# Altium schematic sheet analog.SchDoc
size A3; SheetNumber: 4; SheetTotal: 4
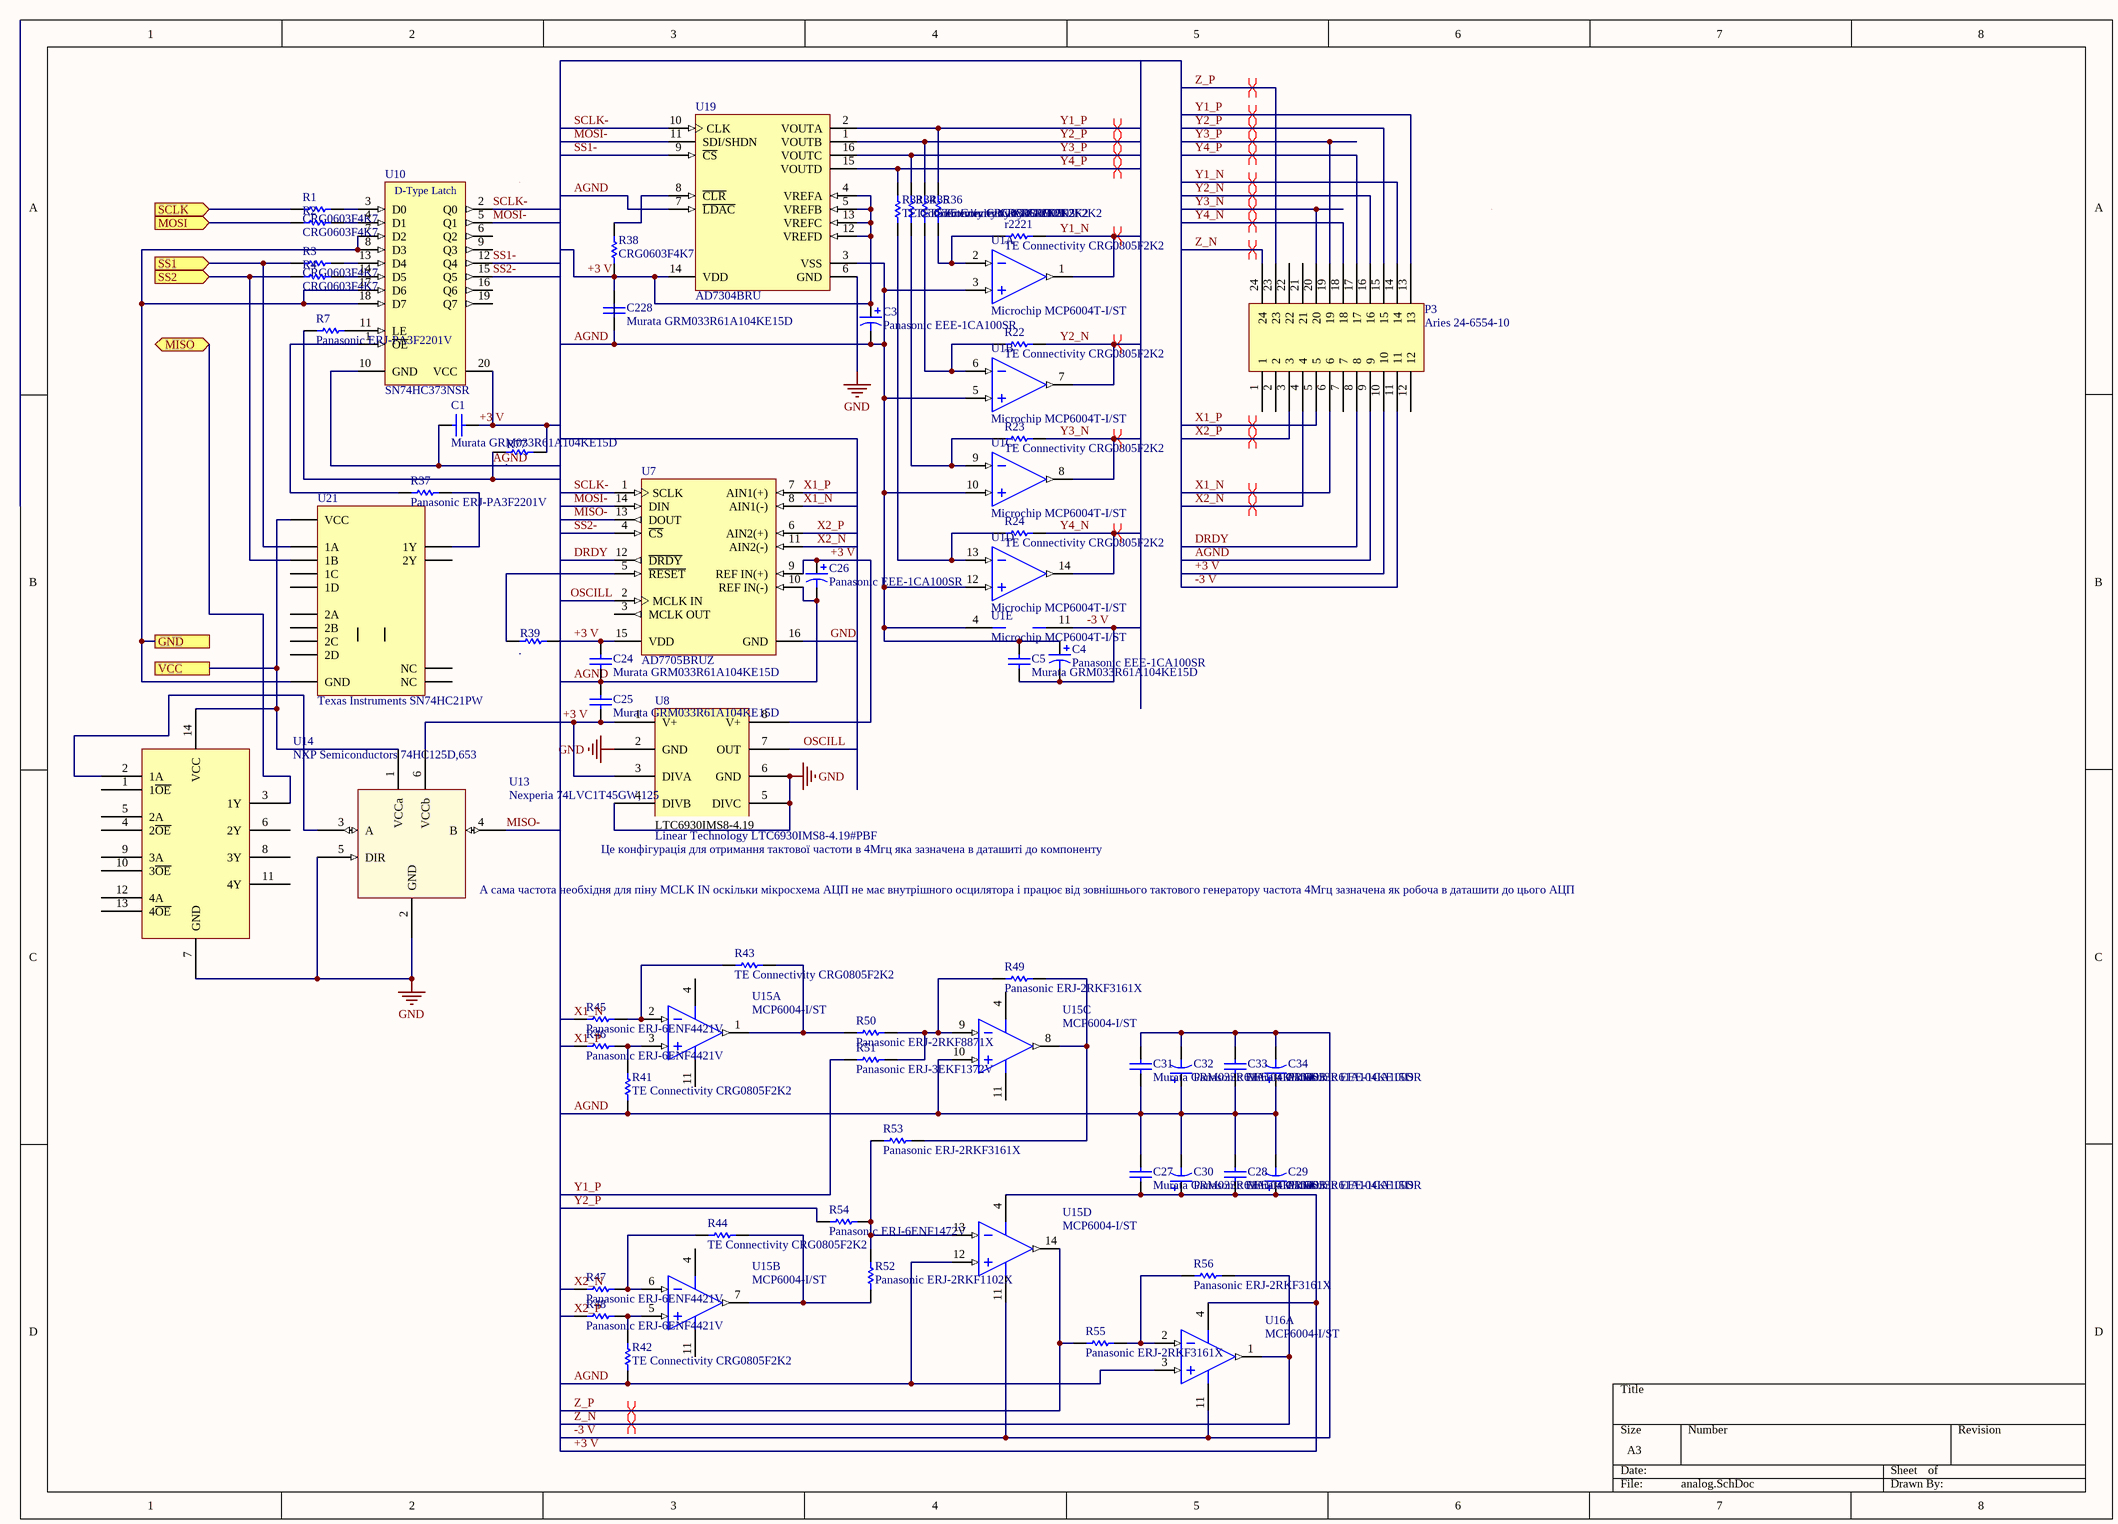
[diagram p0: analog.SchDoc]

## Parts
C1  Murata GRM033R61A104KE15D  [201-cap]
C3  Panasonic EEE-1CA100SR  [PCB-5c7lwdch6d5n3jfyiyq6-1]
C4  Panasonic EEE-1CA100SR  [PCB-5c7lwdch6d5n3jfyiyq6-1]
C5  Murata GRM033R61A104KE15D  [201-cap]
C24  Murata GRM033R61A104KE15D  [201-cap]
C25  Murata GRM033R61A104KE15D  [201-cap]
C26  Panasonic EEE-1CA100SR  [PCB-5c7lwdch6d5n3jfyiyq6-1]
C27  Murata GRM033R61A104KE15D  [201-cap]
C28  Murata GRM033R61A104KE15D  [201-cap]
C29  Panasonic EEE-1CA100SR  [PCB-5c7lwdch6d5n3jfyiyq6-1]
C30  Panasonic EEE-1CA100SR  [PCB-5c7lwdch6d5n3jfyiyq6-1]
C31  Murata GRM033R61A104KE15D  [201-cap]
C32  Panasonic EEE-1CA100SR  [PCB-5c7lwdch6d5n3jfyiyq6-1]
C33  Murata GRM033R61A104KE15D  [201-cap]
C34  Panasonic EEE-1CA100SR  [PCB-5c7lwdch6d5n3jfyiyq6-1]
C228  Murata GRM033R61A104KE15D  [201-cap]
P3  Aries 24-6554-10  [PCB-ekyruasckp3dwikngkzw-1]
R1  CRG0603F4K7  [RESC1609X50X30ML10T20]
R2  CRG0603F4K7  [RESC1609X50X30ML10T20]
R3  CRG0603F4K7  [RESC1609X50X30ML10T20]
R4  CRG0603F4K7  [RESC1609X50X30ML10T20]
R7  Panasonic ERJ-PA3F2201V  [RESC1608X55X30LL15T15]
R22  TE Connectivity CRG0805F2K2  [RESC3216X70X50LL05T20]
R23  TE Connectivity CRG0805F2K2  [RESC3216X70X50LL05T20]
R24  TE Connectivity CRG0805F2K2  [RESC3216X70X50LL05T20]
R33  TE Connectivity CRG0805F2K2  [RESC3216X70X50LL05T20]
R34  TE Connectivity CRG0805F2K2  [RESC3216X70X50LL05T20]
R35  TE Connectivity CRG0805F2K2  [RESC3216X70X50LL05T20]
R36  TE Connectivity CRG0805F2K2  [RESC3216X70X50LL05T20]
R37  Panasonic ERJ-PA3F2201V  [RESC1608X55X30LL15T15]
R38  CRG0603F4K7  [RESC1609X50X30ML10T20]
R39  .  [RESC1608X55X30LL15T15]
R41  TE Connectivity CRG0805F2K2  [RESC3216X70X50LL05T20]
R42  TE Connectivity CRG0805F2K2  [RESC3216X70X50LL05T20]
R43  TE Connectivity CRG0805F2K2  [RESC3216X70X50LL05T20]
R44  TE Connectivity CRG0805F2K2  [RESC3216X70X50LL05T20]
R45  Panasonic ERJ-6ENF4421V  [RESC2013X70X40ML20T20]
R46  Panasonic ERJ-6ENF4421V  [RESC2013X70X40ML20T20]
R47  Panasonic ERJ-6ENF4421V  [RESC2013X70X40ML20T20]
R48  Panasonic ERJ-6ENF4421V  [RESC2013X70X40ML20T20]
R49  Panasonic ERJ-2RKF3161X  [RESC1005X40X25ML05T05]
R50  Panasonic ERJ-2RKF8871X  [RESC1005X40X25ML05T05]
R51  Panasonic ERJ-3EKF1372V  [RESC1608X55X30LL15T15]
R52  Panasonic ERJ-2RKF1102X  [RESC1005X40X25ML05T05]
R53  Panasonic ERJ-2RKF3161X  [RESC1005X40X25ML05T05]
R54  Panasonic ERJ-6ENF1472V  [RESC2013X70X40LL20T20]
R55  Panasonic ERJ-2RKF3161X  [RESC1005X40X25ML05T05]
R56  Panasonic ERJ-2RKF3161X  [RESC1005X40X25ML05T05]
R77  .  [RESC1608X55X30LL15T15]
r2221  TE Connectivity CRG0805F2K2  [RESC3216X70X50LL05T20]
U1  Microchip MCP6004T-I/ST  [PCB-qd5l9gv8ivpyuc7qt6ns-1]  (parts A,B,C,D,E of 5)
U7  AD7705BRUZ  [RU-16_N]
U8  Linear Technology LTC6930IMS8-4.19#PBF  [PCB-f6jmd1xdx0tvjqeq7wyy-1]
U10  SN74HC373NSR  [PCB-mrivl7f71t22rnyfb9oh-1]
U13  Nexperia 74LVC1T45GW,125  [PCB-2kx227qvn7pif93bx96a-1]
U14  NXP Semiconductors 74HC125D,653  [SO14]
U15  MCP6004-I/ST  [TSSOP-ST14_L]  (parts A,B,C,D of 4)
U16  MCP6004-I/ST  [TSSOP-ST14_L]  (part A of 4)
U19  AD7304BRU  [RU-16_M]
U21  Texas Instruments SN74HC21PW  [PCB-zlibg0os7u66y1b7c6dv-1]

## Ports
GND, MISO (bidir), MOSI (in), SCLK (in), SS1 (in), SS2 (in), VCC

## Nets
GND: U7.16(GND) U8.2(GND) U8.4(DIVB) U8.5(DIVC) U8.6(GND) U13.2(GND) U13.5(DIR) U14.7(GND) U19.6(GND)
+3 V: C1.2 C3.1 C24.1 C25.2 C26.1 C27.2 C28.2 C29.1 C30.1 C228.1 P3.10 R38.1 R39.2 R77.2 U7.9(REF_IN(+)) U7.15(VDD) U8.1(V+) U8.3(DIVA) U8.8(V+) U10.20(VCC) U13.6(VCCb) U15.4(VDD) U16.4(VDD) U19.4(VREFA) U19.5(VREFB) U19.12(VREFD) U19.13(VREFC) U19.14(VDD)
-3 V: C4.2 C5.2 C31.1 C32.2 C33.1 C34.2 P3.11 U1.11(VSS) U15.11(VSS) U16.11(VSS)
AGND: C1.1 C3.2 C4.1 C5.1 C24.2 C25.1 C26.2 C27.1 C28.1 C29.2 C30.2 C31.2 C32.1 C33.2 C34.1 C228.2 P3.9 R7.1 R41.1 R42.1 R77.1 U1.3(INA+) U1.4(VDD) U1.5(INB+) U1.10(INC+) U1.12(IND+) U7.10(REF_IN(-)) U10.10(GND) U15.10(VINC+) U15.12(VIND+) U16.3(VINA+) U19.3(VSS) U19.7(~{LDAC})
DRDY: P3.8 U7.12(~{DRDY})
GND: U10.7(D2) U10.8(D3) U10.17(D6) U10.18(D7) U21.7(GND) ; port GND  [a separate net that carries the same name]
MISO: U14.3(1Y) ; port MISO
MISO-: U7.13(DOUT) U13.4(B)
MOSI: R2.1 ; port MOSI
MOSI-: U7.14(DIN) U10.5(Q1) U19.11(SDI/SHDN)
OSCILL: U7.2(MCLK_IN) U8.7(OUT)
SCLK: R1.1 ; port SCLK
SCLK-: U7.1(SCLK) U10.2(Q0) U19.10(CLK)
SS1: R3.1 U21.1(1A) ; port SS1
SS1-: U10.12(Q4) U19.9(~{CS})
SS2: R4.1 U21.2(1B) ; port SS2
SS2-: U7.4(~{CS}) U10.15(Q5)
VCC: U13.1(VCCa) U14.14(VCC) U21.14(VCC) ; port VCC
X1_N: P3.6 R45.1 U7.8(AIN1(-))
X1_P: P3.5 R46.1 U7.7(AIN1(+))
X2_N: P3.4 R47.1 U7.11(AIN2(-))
X2_P: P3.3 R48.1 U7.6(AIN2(+))
Y1_N: P3.14 r2221.2 U1.1(OUTA)
Y1_P: P3.13 R36.2 R51.1 U19.2(VOUTA)
Y2_N: P3.16 R22.2 U1.7(OUTB)
Y2_P: P3.15 R35.2 R54.1 U19.1(VOUTB)
Y3_N: P3.20 R23.2 U1.8(OUTC)
Y3_P: P3.19 R34.2 U19.16(VOUTC)
Y4_N: P3.18 R24.2 U1.14(OUTD)
Y4_P: P3.17 R33.2 U19.15(VOUTD)
Z_N: P3.24 R56.2 U16.1(VOUTA)
Z_P: P3.23 R55.1 U15.14(VOUTD)
NetR1_2: R1.2 U10.3(D0)
NetR2_2: R2.2 U10.4(D1)
NetR3_2: R3.2 U10.13(D4)
NetR4_2: R4.2 U10.14(D5)
NetR7_2: R7.2 U10.11(LE)
NetR22_1: R22.1 R35.1 U1.6(INB-)
NetR23_1: R23.1 R34.1 U1.9(INC-)
NetR24_1: R24.1 R33.1 U1.13(IND-)
NetR36_1: R36.1 r2221.1 U1.2(INA-)
NetR37_1: R37.1 U10.1(~{OE})
NetR37_2: R37.2 U21.6(1Y)
NetR38_2: R38.2 U19.8(~{CLR})
NetR39_1: R39.1 U7.5(~{RESET})
NetR41_2: R41.2 R46.2 U15.3(VINA+)
NetR42_2: R42.2 R48.2 U15.5(VINB+)
NetR43_1: R43.1 R50.1 U15.1(VOUTA)
NetR43_2: R43.2 R45.2 U15.2(VINA-)
NetR44_1: R44.1 R52.1 U15.7(VOUTB)
NetR44_2: R44.2 R47.2 U15.6(VINB-)
NetR49_1: R49.1 R50.2 R51.2 U15.9(VINC-)
NetR49_2: R49.2 R53.2 U15.8(VOUTC)
NetR52_2: R52.2 R53.1 R54.2 U15.13(VIND-)
NetR55_2: R55.2 R56.1 U16.2(VINA-)
NetU13_3: U13.3(A) U14.2(1A)

Not connected (* = marked no-connect by the designer): P3 1 2 7 12 21 22; U7 3(MCLK_OUT); U10 6(Q2) 9(Q3) 16(Q6) 19(Q7); U14 1(1~{OE}) 4(2~{OE}) 5(2A) 6(2Y) 8(3Y) 9(3A) 10(3~{OE}) 11(4Y) 12(4A) 13(4~{OE}); U21 3(NC) 4(1C) 5(1D) 8(2Y) 9(2A) 10(2B) 11(NC) 12(2C) 13(2D)

## Layout directives
differential pair: X1_N, X1_P, X2_N, X2_P, Y1_N, Y1_P, Y2_N, Y2_P, Y3_N, Y3_P, Y4_N, Y4_P, Z_N, Z_P

## Notes on the sheet
- (near U8) Це конфігурація для отримання тактової частоти в 4Мгц яка зазначена в даташиті до компоненту
- (near U13) А сама частота необхідня для піну MCLK IN оскільки мікросхема АЦП не має внутрішного осцилятора і працює від зовнішнього тактового генератору частота 4Мгц зазначена як робоча в даташити до цього АЦП
- (in symbol CMP-209beb569da8ff5c-2) D-Type Latch
- (in symbol CMP-b5277c902da26ae0-2) LTC6930IMS8-4.19

## Library data of the parts
C1 C5 C24 C25 C27 C28 C31 C33 C228 = CMP-118834-6: Cap Ceramic 0.1uF 10V X5R 10% SMD 0201 85C Paper T/R; Lead-Free Status: Lead Free; Case/Package (SI): 0603; Capacitance: 100 nF; REACH SVHC Compliance: No SVHC; Capacitance Tolerance: ±10%; Voltage Rating (DC): 10 V; Lifecycle Status: Active; Octopart Url: https://octopart.com/grm033r61a104ke15d-murata-9105476; Footprint: PCB-ocfpa7uzfom1ouwa1npm-1; Size-Length: 0.0006 m; Size-Thickness: 0.0003 m; Manufacturer Part Number: GRM033R61A104KE15D; Dielectric Characteristic: X5R; OctopartID: 128bdb0bc7a9cd4c; RoHS: Compliant; Size-Width: 0.0003 m
C3 C4 C26 C29 C30 C32 C34 = CMP-1d6cd72bfd77c2ab-7: Capacitor Alum Elec, 10uf, 16v, 20%, Scapacitor Alum Elec, 10uf, 16v, 20%, Smd, Full Reel; Footprint: PCB-yczte4gnpn9q1jdovplr-1
P3 = CMP-1a82d3838c70c545-1: Connector Test Socket Receptacle 24 Position 2.54mm Solder Straight Thru-Hole; Number of Positions: 24; Lead-Free Status: Lead Free; Insulation Resistance: 1.00 GΩ; Number of Mating Cycles: 25000; Mounting Angle: 180 °; Contact Material: Beryllium Copper; Flammability Rating: UL 94 V-0; Size-Width: 22.9 mm; Number of Contacts: 24; Number of Pins: 24; Packaging: Tube; Octopart URL: https://octopart.com/24-6554-10-aries-766868; Contact Plating: Tin, Tin over Nickel; RoHS: Compliant; Size-Height: 11.9 mm; Size-Length: 44.2 mm; Manufacturer Part Number: 24-6554-10; Mounting Style: PC Board, Through Hole, Vertical; OctopartID: 1a82d3838c70c545; Operating Temperature: 105 °C (max); REACH SVHC Compliance: No SVHC
R1-R4 R38 = CMP-0018c9d2ab3ddfdf-10: Res Thick Film 0603 4.7K Ohm 1% 0.1W(1/10W) ±100ppm/C Pad SMD T/R; ELV Compliant: Compliant; Power Rating: 100 mW; Resistance: 4.70 kΩ; Octopart Url: https://octopart.com/crg0603f4k7-te+connectivity-12619331; RoHS: Compliant; Mounting Style: Surface Mount; OctopartID: 0018c9d2ab3ddfdf; Manufacturer Part Number: CRG0603F4K7; Lifecycle Status: Active; Packaging: Tape & Reel (TR)
R7 R37 = CMP-b7b87dbc5d06687f-2: Res Thick Film 0603 2.2K Ohm 1% 0.25W(1/4W) ±100ppm/C Pad SMD Automotive T/R; Temperature Coefficient: -100 ppm/°C to 100 ppm/°C; Resistance: 2.20 kΩ; Case/Package (SI): 1608; Power Rating: 250 mW; Voltage Rating (DC): 150 V; RoHS: Compliant; Packaging: Cut Tape (CT); Lifecycle Status: Not Listed by Manufacturer; Manufacturer Part Number: ERJ-PA3F2201V; Resistance Tolerance: ±1%; Footprint: PCB-0002-00066-3; OctopartID: b7b87dbc5d06687f; Octopart URL: https://octopart.com/erj-pa3f2201v-panasonic-51302360; REACH SVHC Compliance: No SVHC; Case/Package: 1608, 0603
R22-R24 R33-R36 R41-R44 r2221 = CMP-5b0a92f52cd384cd-1: Res Thick Film 0805 2.2K Ohm 1% 0.125W(1/8W) ±100ppm/C Pad SMD T/R; Resistance: 2.20 kΩ; ELV Compliant: Compliant; Power Rating: 125 mW; Case/Package (SI): 2012; OctopartID: 5b0a92f52cd384cd; Case/Package: 0805; Mounting Style: Surface Mount; Manufacturer Part Number: CRG0805F2K2; Octopart Url: https://octopart.com/crg0805f2k2-te+connectivity-16077503; RoHS: Compliant; Lifecycle Status: Active; Packaging: Tape & Reel (TR)
R39 R77 = CMP-b7b87dbc5d06687f-2: Res Thick Film 0603 2.2K Ohm 1% 0.25W(1/4W) ±100ppm/C Pad SMD Automotive T/R; Manufacturer Part Number: ERJ-PA3F2201V; Temperature Coefficient: -100 ppm/°C to 100 ppm/°C; Resistance: 2.20 kΩ; Case/Package (SI): 1608; Power Rating: 250 mW; Voltage Rating (DC): 150 V; RoHS: Compliant; Packaging: Cut Tape (CT); Lifecycle Status: Not Listed by Manufacturer; Resistance Tolerance: ±1%; Footprint: PCB-0002-00066-3; OctopartID: b7b87dbc5d06687f; Octopart URL: https://octopart.com/erj-pa3f2201v-panasonic-51302360; REACH SVHC Compliance: No SVHC; Case/Package: 1608, 0603
R45-R48 = CMP-3915389-2: RESISTOR, THICK FILM, 4.42KOHM, 125mW, ± 1%; Case/Package (SI): 2012; Lead-Free Status: Lead Free; Power Rating: 0.125 W; Resistance: 4420.0 Ω; Voltage Rating (DC): 150.0 V; Manufacturer Part Number: ERJ-6ENF4421V; Case/Package: 0805; Lifecycle Status: Not Listed by Manufacturer; Mounting Style: Surface Mount; Octopart Url: https://octopart.com/erj-6enf4421v-panasonic-55405047; OctopartID: a5ed6faae97c7a2a; REACH SVHC Compliance: No SVHC; Resistance Tolerance: ±1%; RoHS: Compliant; Size-Height: 0.0006 m; Size-Length: 0.002 m; Size-Width: 0.00125 m
R49 R53 R55 R56 = CMP-3651018-2: Thick Film Resistors - SMD 0402 3.16Kohms 1% Tol; Lead-Free Status: Lead Free; Power Rating: 0.1 W; Resistance: 3160.0 Ω; Voltage Rating (DC): 50.0 V; Case/Package: 0402; Lifecycle Status: Not Listed by Manufacturer; Mounting Style: Surface Mount; Octopart Url: https://octopart.com/erj-2rkf3161x-panasonic-55421100; OctopartID: ad456702208f7282; REACH SVHC Compliance: No SVHC; Resistance Tolerance: ±1%; RoHS: Compliant; Size-Height: 0.00035 m; Size-Length: 0.001 m; Size-Width: 0.0005 m; Manufacturer Part Number: ERJ-2RKF3161X
R50 = CMP-3673565-2: Thick Film Resistors - SMD 0402 8.87Kohms 1% Tol; Lead-Free Status: Contains Lead; Power Rating: 0.1 W; Resistance: 8870.0 Ω; Voltage Rating (DC): 50.0 V; Manufacturer Part Number: ERJ-2RKF8871X; Case/Package: 0402; Lifecycle Status: Not Listed by Manufacturer; Mounting Style: Surface Mount; Octopart Url: https://octopart.com/erj-2rkf8871x-panasonic-55421316; OctopartID: d2f818bf5e1a0d3f; REACH SVHC Compliance: No SVHC; Resistance Tolerance: ±1%; RoHS: Compliant; Size-Height: 0.00035 m; Size-Length: 0.001 m; Size-Width: 0.0005 m
R51 = CMP-3656443-2: Thick Film Resistors - SMD 0603 13.7Kohms 1% Tol; Lead-Free Status: Contains Lead; Power Rating: 0.1 W; Resistance: 13700.0 Ω; Voltage Rating (DC): 75.0 V; Manufacturer Part Number: ERJ-3EKF1372V; Case/Package: 0603; Lifecycle Status: Not Listed by Manufacturer; Mounting Style: Surface Mount; Octopart Url: https://octopart.com/erj-3ekf1372v-panasonic-55411167; OctopartID: ddb117f679080276; Packaging: Cut Tape (CT); REACH SVHC Compliance: No SVHC; Resistance Tolerance: ±1%; RoHS: Compliant; Size-Height: 0.00045 m; Size-Length: 0.0016 m; Size-Width: 0.0008 m
R52 = CMP-1847061-3: Res Thick Film 0402 11K Ohm 1% 1/10W ±100ppm/C Molded SMD Punched Carrier T/R; Voltage Rating (DC): 50.0 V; Lead-Free Status: Lead Free; Resistance: 11000.0 Ω; Power Rating: 0.1 W; Size-Length: 0.001 m; RoHS: Compliant; Resistance Tolerance: ±1%; Octopart Url: https://octopart.com/erj-2rkf1102x-panasonic-55389235; Manufacturer Part Number: ERJ-2RKF1102X; OctopartID: bb9871dfb2cd645f; REACH SVHC Compliance: No SVHC; Size-Width: 0.0005 m; Lifecycle Status: Not Listed by Manufacturer; Size-Height: 0.00035 m; Case/Package: 0402; Footprint: PCB-406olm0ev1nhc4a39vl6-1; Packaging: Cut Tape (CT); Mounting Style: Surface Mount
R54 = CMP-3677441-2: Thick Film Resistors - SMD 0805 14.7Kohms 1% Tol; Case/Package (SI): 2012; Lead-Free Status: Lead Free; Power Rating: 0.125 W; Resistance: 14700.0 Ω; Voltage Rating (DC): 150.0 V; Case/Package: 0805; Lifecycle Status: Not Listed by Manufacturer; Mounting Style: Surface Mount; Octopart Url: https://octopart.com/erj-6enf1472v-panasonic-55422409; OctopartID: 6956a311e1f9b691; REACH SVHC Compliance: No SVHC; Resistance Tolerance: ±1%; RoHS: Compliant; Size-Height: 0.0006 m; Size-Length: 0.002 m; Size-Width: 0.00125 m; Manufacturer Part Number: ERJ-6ENF1472V
U1 = CMP-1324864-8: MCP6004 Series 6 V 1 MHz SMT Low-Power Operational Amplifier - TSSOP-14
U7 = CMP-16014805-4: Dual 16-Bit Sigma-Delta Analog-to-Digital Converter with Serial, SPI Interface, 1 mW, 3 V / 5 V, 500SPS, -40 to +85 degC, RU-16, Pb-Free, Tube; Mil-Spec: No; Number of Bits: 16; Input Impedance: 9000000000.0 Ω; Sample Rate: 500.0 Hz; Lead-Free Status: Contains Lead; Resolution (Bits): 16.0; Supply Current: 0.0013 A; Power Dissipation: 0.0065 W; Input Capacitance: 1e-11 F; Number of Pins: 16; Manufacturer Part Number: AD7705BRUZ; RoHS: Compliant; Packaging: Bulk; Case/Package: TSSOP; OctopartID: 1cf3d5ff1dbec334; Mounting Style: Surface Mount; REACH SVHC Compliance: No SVHC; Octopart Url: https://octopart.com/ad7705bruz-analog+devices-402475; Lifecycle Status: Active
U8 = CMP-b5277c902da26ae0-2: SC-Timing, 32.76kHz-8.192MHz Precision u; SC-Timing, 32.76kHz-8.192MHz Precision uPower Oscillators; Manufacturer Part Number: LTC6930IMS8-5.00#PBF; Frequency: 5.00 MHz; Supply Voltage (DC): 1.70 V (min); Case/Package: MSOP; RoHS: Compliant; Octopart URL: http://octopart.com/ltc6930ims8-5.00%23pbf-linear+technology-12434915; Number of Pins: 8; OctopartID: b5277c902da26ae0
U10 = CMP-209beb569da8ff5c-2: Octal Transparent D-Type Latches With 3-State Outputs 20-SO -40 to 85; Output Current: 7.80 mA; Supply Voltage (DC): 2.00 V to 6.00 V; Output Current Drive: -1.00 mA; Number of Circuits: 8; Voltage Nodes: 6.00 V, 5.00 V, 2.00 V; Lead-Free Status: Lead Free; Polarity: Non-Inverting; Propagation Delay Max (tpd): 32.0 ns; RoHS: Compliant; Octopart URL: http://octopart.com/sn74hc373nsr-texas+instruments-46635093; Number of Pins: 20; REACH SVHC Compliance: No SVHC; Packaging: Tape & Reel (TR); Manufacturer Part Number: SN74HC373NSR; OctopartID: 209beb569da8ff5c; Case/Package: SOP; Number of Outputs: 8; Number of Bits: 8; Mounting Style: Surface Mount; Lifecycle Status: Active
U13 = CMP-9dea5051caa8422d-3: 74LVC1T45; 74LVCH1T45 - Dual supply translating transceiver; 3-state; Supply Voltage (DC): 5.50 V (max), 1.20 V (min); Lead-Free Status: Lead Free; Lifecycle Status: Active; Manufacturer Part Number: 74LVC1T45GW,125; RoHS: Compliant; OctopartID: 9dea5051caa8422d; Number of Pins: 6; Octopart URL: https://octopart.com/74lvc1t45gw%2C125-nexperia-78737956; REACH SVHC Compliance: No SVHC; Operating Temperature: -40.0 °C (min); Case/Package: SOT-363; Mounting Style: Surface Mount; Packaging: Tape & Reel (TR)
U14 = CMP-e63b2fae16a839fc-1: 74HC Series 6 V Surface Mount 3-State Quad Buffer/Line Driver - SOIC-14; Lead-Free Status: Lead Free; Number of Gates: 4; Supply Voltage (DC): 2.00 V (min); REACH SVHC Compliance: No SVHC; Lifecycle Status: Active; Packaging: Tape & Reel (TR); Manufacturer Part Number: 74HC125D,653; OctopartID: e63b2fae16a839fc; Octopart URL: http://octopart.com/74hc125d%2C653-nxp+semiconductors-10474997; Number of Pins: 14; RoHS: Compliant
U15 U16 = CMP-1319670-3: 1 MHz, Low-Power Operational Amplifier, 14-Pin TSSOP, Industrial Temperature; Bandwidth: 1000000.0 Hz; Input Offset Drift: 2e-06 V/K; Lead-Free Status: Lead Free; Number of Circuits: 4; Slew Rate: 0.6 V/μs; Gain Bandwidth Product: 1000000.0 Hz; Lifecycle Status: Active; Mounting Style: Surface Mount; Number of Pins: 14; Octopart Url: https://octopart.com/mcp6004-i%2Fst-microchip-419111; OctopartID: 6e09a7052e48b1ce; REACH SVHC Compliance: No SVHC; RoHS: Compliant; Manufacturer Part Number: MCP6004-I/ST
U19 = CMP-4908888-3: Quad 8-Bit Rail-to-Rail Output Digital-to-Analog Converter, 3 V / 5 V, -40 to +85 degC, RU-16, Tube; Lead-Free Status: Contains Lead; Mil-Spec: No; Number of Bits: 8; Power Dissipation: 0.06 W; Resolution (Bits): 8.0; Manufacturer Part Number: AD7304BRU; Case/Package: TSSOP; Lifecycle Status: Active; Mounting Style: Surface Mount; Number of Pins: 16; Octopart Url: https://octopart.com/ad7304bru-analog+devices-435563; OctopartID: 939e5a9213934c59; Packaging: Bulk; RoHS: Non-Compliant
U21 = CMP-6615af12324ab9d2-2: AND Gate 2-Element 4-IN CMOS 14-Pin TSSOP Tube; Number of Bits: 2; Output Current Drive: -1.00 mA; Supply Voltage (DC): 2.00 V to 6.00 V; Lead-Free Status: Lead Free; Propagation Delay Max (tpd): 140 ns, 24.0 ns; Output Current: 5.20 mA; Voltage Nodes: 2.00 V, 5.00 V, 6.00 V, 4.50 V; Octopart URL: https://octopart.com/sn74hc21pw-texas+instruments-880953; Manufacturer Part Number: SN74HC21PW; OctopartID: 6615af12324ab9d2; REACH SVHC Compliance: No SVHC; Number of Pins: 14; RoHS: Compliant; Case/Package: TSSOP; Packaging: Tube, Rail; Lifecycle Status: Active; Mounting Style: Surface Mount; Number of Gates: 2; Operating Temperature: -40.0 °C to 85.0 °C